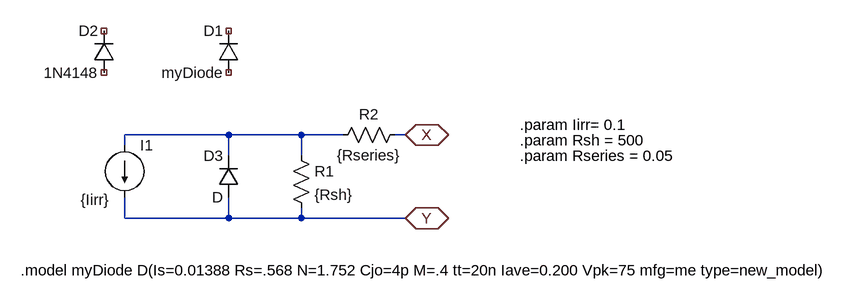
[diagram p0: schematic PV_Motif_Solar_Cell.asc]
PV_Motif_Solar_Cell.asc, the LTspice schematic file:
Version 4
SHEET 1 1536 680
WIRE 256 112 96 112
WIRE 368 112 256 112
WIRE 432 112 368 112
WIRE 528 112 512 112
WIRE 96 128 96 112
WIRE 256 144 256 112
WIRE 368 144 368 112
WIRE 96 240 96 208
WIRE 256 240 256 208
WIRE 256 240 96 240
WIRE 368 240 368 224
WIRE 368 240 256 240
WIRE 528 240 368 240
FLAG 528 112 X
IOPIN 528 112 BiDir
FLAG 528 240 Y
IOPIN 528 240 BiDir
SYMBOL current 96 128 R0
WINDOW 123 0 0 Left 0
WINDOW 39 0 0 Left 0
WINDOW 3 -68 84 Left 2
SYMATTR Value {Iirr}
SYMATTR InstName I1
SYMBOL res 352 128 R0
SYMATTR InstName R1
SYMATTR Value {Rsh}
SYMBOL res 528 96 R90
WINDOW 0 0 56 VBottom 2
WINDOW 3 32 56 VTop 2
SYMATTR InstName R2
SYMATTR Value {Rseries}
SYMBOL diode 272 16 R180
WINDOW 0 24 64 Left 2
WINDOW 3 24 0 Left 2
SYMATTR InstName D1
SYMATTR Value myDiode
SYMBOL diode 80 16 R180
WINDOW 0 24 64 Left 2
WINDOW 3 24 0 Left 2
SYMATTR InstName D2
SYMATTR Value 1N4148
SYMBOL diode 272 208 R180
WINDOW 0 24 64 Left 2
WINDOW 3 24 0 Left 2
SYMATTR InstName D3
TEXT 704 96 Left 2 !.param Iirr= 0.1
TEXT 704 120 Left 2 !.param Rsh = 500
TEXT 704 144 Left 2 !.param Rseries = 0.05
TEXT -64 320 Left 2 !.model myDiode D(Is=0.01388 Rs=.568 N=1.752 Cjo=4p M=.4 tt=20n Iave=0.200 Vpk=75 mfg=me type=new_model)

The netlist it stands for:
* PV_Motif_Solar_Cell.asc
I1 N001 Y {Iirr}
R1 N001 Y {Rsh}
R2 X N001 {Rseries}
D1 NC_01 NC_02 myDiode
D2 NC_03 NC_04 1N4148
D3 Y N001 D
.model D D
.lib standard.dio
.param Iirr= 0.1
.param Rsh = 500
.param Rseries = 0.05
.model myDiode D(Is=0.01388 Rs=.568 N=1.752 Cjo=4p M=.4 tt=20n Iave=0.200 Vpk=75 mfg=me type=new_model)
.backanno
.end